# Altium schematic sheet PowerBoard_Rev1.SchDoc
size A4
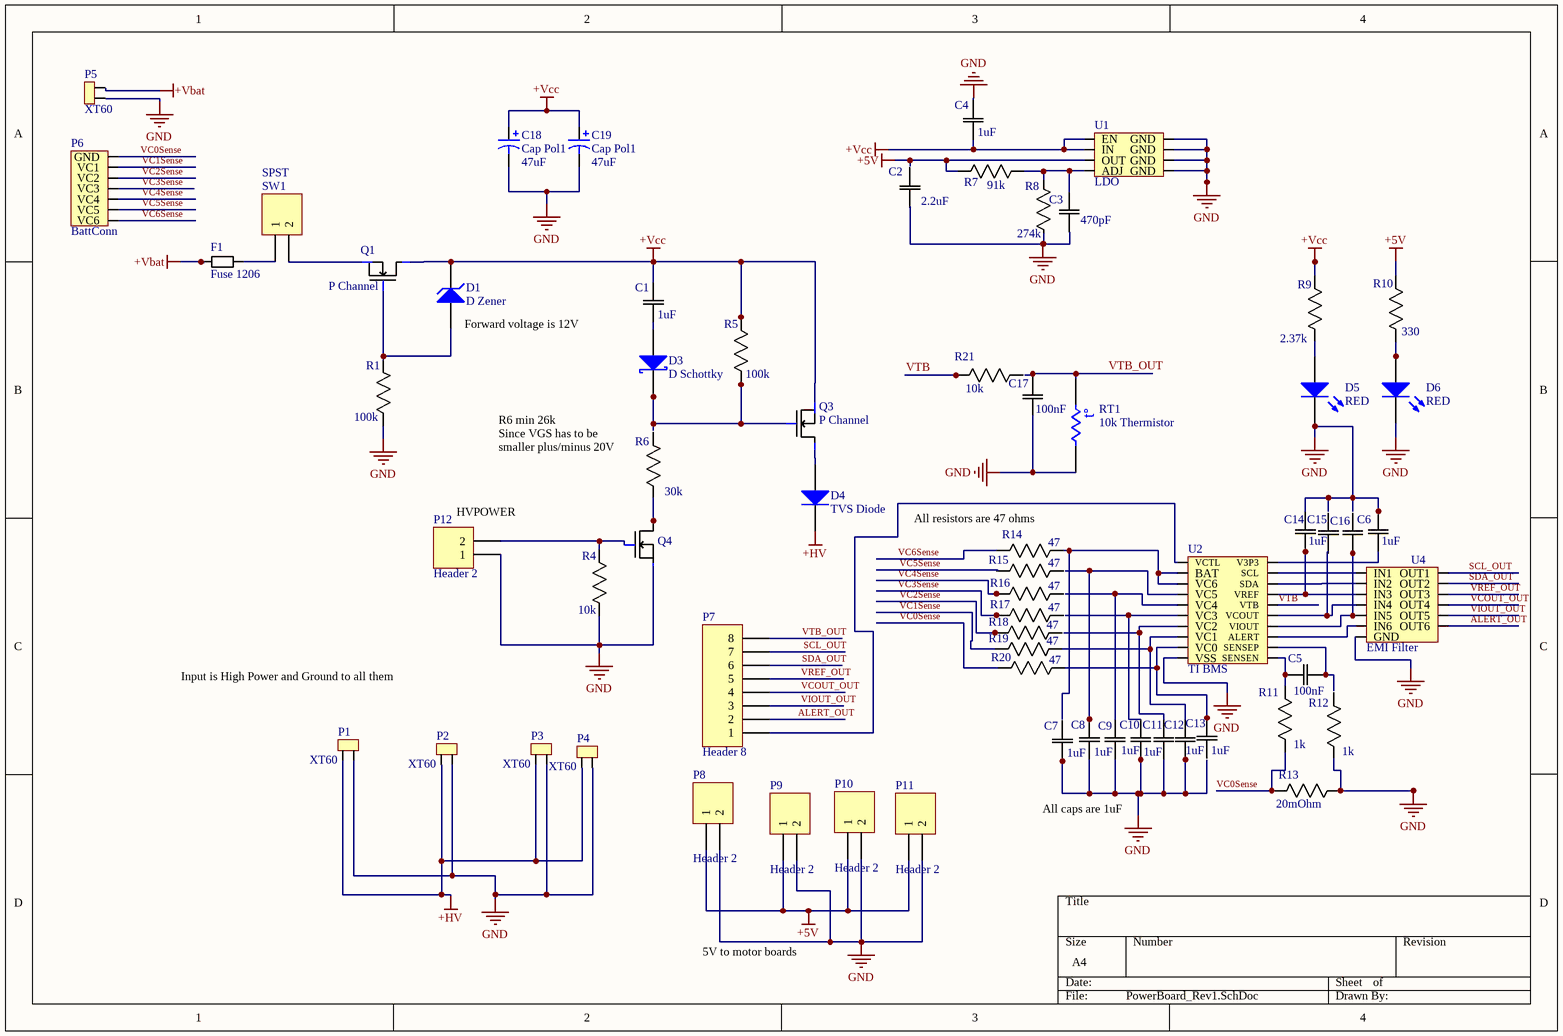
[diagram p0: PowerBoard_Rev1.SchDoc]

## Parts
C1  1uF  [CAPC2013X110N]
C2  2.2uF  [CAPC2013X110N]
C3  470pF  [CAPC2013X110N]
C4  1uF  [CAPC2013X110N]
C5  100nF  [CAPC2013X110N]
C6  1uF  [CAPC2013X110N]
C7  1uF  [CAPC2013X110N]
C8  1uF  [CAPC2013X110N]
C9  1uF-0805  [CAPC2013X110N]  (value not drawn)
C10  1uF  [CAPC2013X110N]
C11  1uF  [CAPC2013X110N]
C12  1uF  [CAPC2013X110N]
C13  1uF  [CAPC2013X110N]
C14  1uF  [CAPC2013X110N]
C15  100nF  [CAPC2013X110N]  (value not drawn)
C16  100nF  [CAPC2013X110N]  (value not drawn)
C17  100nF  [CAPC2013X110N]
C18  Cap Pol1  value 47uF  [RB7.6-15]
C19  Cap Pol1  value 47uF  [RB7.6-15]
D1  D Zener  [DIODE-0.7]
D3  D Schottky  [SMB]
D4  TVS Diode  [DO-35]
D5  RED  [3.2X1.6X1.1]
D6  RED  [3.2X1.6X1.1]
F1  Fuse 1206  [Fuse1206]
P1  XT60  [XT60Connector]
P2  XT60  [XT60Connector]
P3  XT60  [XT60Connector]
P4  XT60  [XT60Connector]
P5  XT60  [XT60Connector]
P6  BattConn  [6sBattConn]
P7  Header 8  [HDR1X8]
P8  Header 2  [HDR1X2]
P9  Header 2  [HDR1X2]
P10  Header 2  [HDR1X2]
P11  Header 2  [HDR1X2]
P12  Header 2  [HDR1X2]
Q1  P Channel  [PChannelMosfet]
Q3  P Channel  [PChannelMosfet]
Q4  N-Channel  [SOIC127P600X170-8N]  (value not drawn)
R1  100k  [RESC2013X65N]
R4  10k  [RESC2013X65N]
R5  100k  [RESC2013X65N]
R6  30k  [RESC2013X65N]
R7  91k  [RESC2013X65N]
R8  274k  [RESC2013X65N]
R9  2.37k  [RESC2013X65N]
R10  330  [RESC2013X65N]
R11  1k  [RESC2013X65N]
R12  1k  [RESC2013X65N]
R13  20mOhm  [RESC2013X65N]
R14  47  [RESC2013X65N]
R15  47  [RESC2013X65N]
R16  47  [RESC2013X65N]
R17  47  [RESC2013X65N]
R18  47  [RESC2013X65N]
R19  47  [RESC2013X65N]
R20  47  [RESC2013X65N]
R21  10k  [RESC2013X65N]
RT1  10k Thermistor  [6-0805_N]
SW1  SPST  [HDR1X2]
U1  LDO  [SOIC127P600X170-8N]
U2  TI BMS  [TSOP65P640X120-20N]
U4  EMI Filter  [Filter]

## Nets
+5V: P8.1 P9.1 P10.1 P11.1 R7.2(R2) R10.1(R1) U1.OUT
+HV: D4.2(K) P1.1 P2.1 P3.1 P4.1
+Vbat: F1.1 P5.2
+Vcc: C1.2(C2) C4.1(C1) C18.1 C19.1 D1.2(K) Q1.S Q3.D R5.1(R1) R9.1(R1) U1.EN U1.IN
GND: C2.1(C1) C4.2(C2) C6.2(C2) C7.1(C1) C8.1(C1) C9.1(C1) C10.1(C1) C11.1(C1) C12.1(C1) C14.2(C2) C17.1(C1) C18.2 C19.2 D5.2(K) D6.2(K) P1.2 P2.2 P3.2 P4.2 P5.1 P8.2 P9.2 P10.2 P11.2 P12.1 Q4.S R1.2(R2) R4.2(R2) R8.2(R2) R12.2(R2) R13.1(R1) RT1.2 U1.GND U2.VSS U4.GND
ALERT_OUT: P7.2 U4.12(OUT6)
SCL_OUT: P7.7 U4.7(OUT1)
SDA_OUT: P7.6 U4.8(OUT2)
VC0Sense: P6.GND R11.2(R2) R13.2(R2) R20.2(R2)
VC1Sense: P6.VC1 R19.2(R2)
VC2Sense: P6.VC2 R18.2(R2)
VC3Sense: P6.VC3 R17.2(R2)
VC4Sense: P6.VC4 R16.2(R2)
VC5Sense: P6.VC5
VC6Sense: P6.VC6 R14.2(R2)
VCOUT_OUT: P7.4 U4.10(OUT4)
VIOUT_OUT: P7.3 U4.11(OUT5)
VREF_OUT: P7.5 U4.9(OUT3)
VTB: R21.1(R1) U2.VTB
VTB_OUT: C17.2(C2) P7.8 RT1.1
NetC1_1: C1.1(C1) D3.1(A)
NetC3_2: C3.2(C2) R7.1(R1) R8.1(R1) U1.ADJ/BYP(ADJ)
NetC5_1: C5.1(C1) U2.SENSEP
NetC5_2: C5.2(C2) R11.1(R1) U2.SENSEN
NetC6_1: C6.1(C1) U2.V3P3
NetC8_2: C8.2(C2) U2.VC5
NetC9_2: C9.2(C2) U2.VC4
NetC10_2: C10.2(C2) U2.VC3
NetC11_2: C11.2(C2) U2.VC2
NetC12_2: C12.2(C2) R19.1(R1) U2.VC1
NetC13_2: C13.2(C2) R20.1(R1) U2.VC0
NetC14_1: C14.1(C1) U2.VREF U4.3(IN3)
NetC16_2: C16.2(C2) U2.VIOUT U4.5(IN5)
NetD1_1: D1.1(A) Q1.G R1.1(R1)
NetD3_2: D3.2(K) Q3.G R5.2(R2)
NetD4_1: D4.1(A) Q3.S
NetD5_1: D5.1(A) R9.2(R2)
NetD6_1: D6.1(A) R10.2(R2)
NetF1_2: F1.2 SW1.1
NetP7_1: P7.1 U2.VCTL
NetP12_2: P12.2 Q4.G R4.1(R1)
NetQ1_D: Q1.D SW1.2
NetQ4_D: Q4.D R6.2(R2)
NetR14_1: R14.1(R1) U2.BAT U2.VC6
NetU2_ALERT: U2.ALERT U4.6(IN6)
NetU2_SCL: U2.SCL U4.1(IN1)
NetU2_SDA: U2.SDA U4.2(IN2)
NetU2_VCOUT: U2.VCOUT U4.4(IN4)

Not connected (* = marked no-connect by the designer): C2 2(C2); C3 1(C1); C7 2(C2); C13 1(C1); C15 1(C1) 2(C2); C16 1(C1); R6 1(R1); R12 1(R1); R15 1(R1) 2(R2); R16 1(R1); R17 1(R1); R18 1(R1); R21 2(R2)

## Notes on the sheet
- (near D1) Forward voltage is 12V
- (near R6) R6 min 26k
  Since VGS has to be smaller plus/minus 20V
- (near P12) HVPOWER
- (near R14) All resistors are 47 ohms
- Input is High Power and Ground to all them
- All caps are 1uF
- 5V to motor boards
- (in symbol Res Thermal) t°

## Library data of the parts
C1 C4 C6-C8 C10-C14 = CAP 1uF 0805: CAP CER 1UF 50V X7R 0805; MP: CL21B105KBFNNNE; MF: Samsung Electro-Mechanics; Tolerance: 10%; Package: 0805; Price: 0,172 CAD; Value: 1uF; Digikey: 1276-1029-1-ND; Digikey Link: https://www.digikey.ca/product-detail/en/samsung-electro-mechanics/CL21B105KBFNNNE/1276-1029-1-ND/3889115; Rating: 50V
C2 = CAP 2.2uF 0805: CAP CER 1UF 50V X7R 0805; MP: C0805C225K4RACTU; MF: KEMET; Tolerance: 10%; Rating: 16V; Package: 0805; Price: 0,461 CAD; Value: 2.2uF; Digikey: 399-3523-1-ND; Digikey Link: https://www.digikey.ca/products/en?keywords=399-3523-1-ND
C3 = CAP 470pF 0805: CAP CER 470PF 50V C0G/NPO 0805; MP: CC0805JRNPO9BN471; MF: Yageo; Tolerance: 5%; Package: 0805; Price: 0,135 CAD; Value: 470pF; Digikey: 311-1119-1-ND; Digikey Link: https://www.digikey.ca/products/en?keywords=311-1119-1-ND; Rating: 50V
C5 C15-C17 = CAP 100nF 0805: CAP CER 0.1UF 50V X7R 0805; MP: CC0805KRX7R9BB104; MF: Yageo; Tolerance: 10%; Package: 0805; Price: 0,119 CAD; Value: 100nF; Digikey: 311-1140-1-ND; Digikey Link: https://www.digikey.ca/products/en?keywords=311-1140-1-ND; Rating: 50V
C9 = C0805C104K5RACTU: Capacitor; Ceramic; Cap; .100UF ; Tol+-10%; SMD; Vol-Rtg 50V; X7R, Tape/Reel; MP: CL21B105KBFNNNE; MF: Samsung Electro-Mechanics; Value: 1uF; Tolerance: 10%; Package: 0805 (2012 Metric); Price: 0.17300 CAD; Digikey: 1276-1029-1-ND; Rating: 50V; Digikey Link: https://www.digikey.ca/products/en?keywords=1276-1029-1-ND
C18 C19 = Cap Pol1: Polarized Capacitor (Radial); Published: 8-Jun-2000; LatestRevisionDate: 17-Jul-2002; LatestRevisionNote: Re-released for DXP Platform.; PackageReference: RB7.6-15; Publisher: Altium Limited; PackageDescription: Polarized Capacitor (Radial); 2 Leads
D1 = D Zener: Zener Diode 10V 1W ±5% Through Hole DO-41; MF: ON Semiconductor; MP: 1N4740ATR; Digikey: 1N4740AFSCT-ND; Digikey Link: https://www.digikey.ca/product-detail/en/on-semiconductor/1N4740ATR/1N4740AFSCT-ND/1532756; Value: 10V; Rating: 1W
D3 = D Schottky: Schottky Diode; Parameter 1: *
D4 = Diode 1N914: High Conductance Fast Diode; MF: STMicroelectronics; MP: P6KE30CA; Rating: 54V; ComponentLink1Description: Manufacturer Link; ComponentLink1URL: http://www.fairchildsemi.com/; ComponentLink2Description: Datasheet; ComponentLink2URL: http://www.fairchildsemi.com/ds/1N%2F1N4448.pdf; Digikey: 497-12048-1-ND; Digikey Link: https://www.digikey.ca/products/en?keywords=497-12048-1-ND; Price: 0.63800 CAD; Value: TVS
D5 D6 = LED RED SMD: Typical RED, GREEN, YELLOW, AMBER GaAs LED; MF: Lite-On Inc.; MP: LTST-C190CKT; Rating: 1.8V; Digikey: 160-1181-1-ND; Digikey Link: https://www.digikey.ca/products/en?keywords=160-1181-1-ND; Package: 0603
F1 = Fuse 10A 1206: 10A 32V AC 63V DC Fuse Board Mount (Cartridge Style Excluded) Surface Mount 1206 (3216 Metric); MF: Schurter Inc.; MP: 3413.0328.22; Digikey: 486-1686-1-ND; Rating: 10A; Digikey Link: https://www.digikey.ca/products/en?keywords=486-1686-1-ND
P1-P5 = XT60 Connector: XT60 CONNECTORS FEMALE PAIR; MF: SparkFun Electronics; MP: PRT-10474; Digikey: 1568-1816-ND; Digikey Link: https://www.digikey.ca/product-detail/en/sparkfun-electronics/PRT-10474/1568-1816-ND/8258064; Package: XT60; Price: 2.13000 CAD; Value: N/A
P6 = Component_1
P7 = Header 8: Header, 8-Pin; LatestRevisionDate: 17-Jul-2002; LatestRevisionNote: Re-released for DXP Platform.; Publisher: Altium Limited
P8-P12 = Header 2: Header, 2-Pin; LatestRevisionDate: 17-Jul-2002; LatestRevisionNote: Re-released for DXP Platform.; Publisher: Altium Limited
Q1 Q3 = Mosfet P Channel: MF: Vishay Siliconix; MP: SI4497DY-T1-GE3; Rating: 30V 36A; Value: P-Channel; Digikey: SI4497DY-T1-GE3CT-ND; Digikey Link: https://www.digikey.ca/products/en?keywords=SI4497DY-T1-GE3CT-ND; Package: 8-SOIC; Tolerance: N/A
Q4 = Mosfet N Channel 8-SOIC: MOSFET N-CH 30V 18.5A 8-SOIC; MF: ON Semiconductor; MP: FDS8813NZ; Digikey: FDS8813NZCT-ND; Price: 1.727 CAD; Rating: 30V; Digikey Link: https://www.digikey.ca/product-detail/en/on-semiconductor/FDS8813NZ/FDS8813NZCT-ND/1626932; Package: 8-SOIC
R1 R5 = RES 100k 0805: RES SMD 100K OHM 1% 1/8W 0805; MP: RC0805FR-07100KL; MF: Yageo; Rating: 0.125W; Digikey: 311-100KCRCT-ND; Price: 0.058 CAD; Package: 0805; Value: 100k; Digikey Link: https://www.digikey.ca/products/en?keywords=311-100KCRCT-ND; Tolerance: 1%
R4 R21 = RES 10k 0805: RES SMD 10K OHM 1% 1/8W 0805; MP: RC0805FR-0710KL; MF: Yageo; Rating: 0.125W; Digikey: 311-10.0KCRCT-ND; Price: 0.061 CAD; Package: 0805; Value: 10k; Digikey Link: https://www.digikey.ca/products/en?keywords=311-10.0KCRCT-ND; Tolerance: 1%
R6 = RES 30k 0805: RES SMD 30K OHM 1% 1/8W 0805; MP: RC0805FR-0730KL; MF: Yageo; Rating: 0.125W; Digikey: 311-30.0KCRDKR-ND; Price: 0.061 CAD; Package: 0805; Value: 30k; Digikey Link: https://www.digikey.ca/products/en?keywords=311-30.0KCRDKR-ND; Tolerance: 1%
R7 = RES 91k 0805: RES SMD 91K OHM 1% 1/8W 0805; MP: RC0805FR-0791KL; MF: Yageo; Rating: 0.125W; Digikey: 311-91.0KCRCT-ND; Price: 0.061 CAD; Package: 0805; Value: 91k; Digikey Link: https://www.digikey.ca/products/en?keywords=311-91.0KCRCT-ND; Tolerance: 1%
R8 = RES 274k 0805: RES SMD 274K OHM 1% 1/8W 0805; MP: RC0805FR-07274KL; MF: Yageo; Rating: 0.125W; Digikey: 311-274KCRCT-ND; Price: 0.061 CAD; Package: 0805; Value: 274k; Digikey Link: https://www.digikey.ca/products/en?keywords=311-274KCRCT-ND; Tolerance: 1%
R9 = RES 2.37k 0805: RES SMD 2.37kOhm 1/4W 0805; MP: RK73H2ATTD2371F; MF: KOA Speer Electronics, Inc.; Rating: 0.25W; Digikey: 2019-RK73H2ATTD2371FCT-ND; Price: 0.053 CAD; Package: 0805; Value: 2.37k; Digikey Link: https://www.digikey.ca/products/en?keywords=2019-RK73H2ATTD2371FCT-ND
R10 = RES 330 0805: RES SMD 330 OHM 1% 1/8W 0805; MP: RC0805FR-07330RL; MF: Yageo; Rating: 0.125W; Digikey: 311-330CRCT-ND; Price: 0.061 CAD; Package: 0805; Value: 330; Digikey Link: https://www.digikey.ca/products/en?keywords=311-330CRCT-ND
R11 R12 = RES 1k 0805: RES SMD 1K OHM 5% 1/8W 0805; MP: RC0805JR-071KL; MF: Yageo; Rating: 0.125W; Digikey: 311-1.0KARCT-ND; Price: 0.048 CAD; Package: 0805; Value: 1k; Digikey Link: https://www.digikey.ca/products/en?keywords=311-1.0KARCT-ND; Tolerance: 5%
R13 = RES 20mOhm 0805: RES 0.02 OHM 1% 1/2W 0805; MP: ERJ-6BWFR020V; MF: Panasonic Electronic Components; Rating: 0.5W; Digikey: P.02AQCT-ND; Price: 0.088 CAD; Package: 0805; Value: 20mOhm; Digikey Link: https://www.digikey.ca/products/en?keywords=P.02AQCT-ND; Tolerance: 1%
R14-R20 = RES 47 0805: RES SMD 47 OHM 1% 1/8W 0805; MP: RC0805FR-0747RL; MF: Yageo; Rating: 0.125W; Digikey: 311-47.0CRCT-ND; Price: 0.061 CAD; Package: 0805; Value: 47; Digikey Link: https://www.digikey.ca/products/en?keywords=311-47.0CRCT-ND; Tolerance: 1%
RT1 = Res Thermal: 490-2456-1-ND; Published: 24-Mar-1999; LatestRevisionDate: 29-May-2009; LatestRevisionNote: IPC-7351 Footprint Added.; PackageVersion: Mar-2003; PackageReference: 6-0805; Publisher: Altium Limited; PackageDescription: Chip Resistor 0805 Case Size; Code_IPC: RESC2012
SW1 = Header 2: SPST Switch; LatestRevisionDate: 17-Jul-2002; LatestRevisionNote: Re-released for DXP Platform.; Publisher: Altium Limited
U1 = U?
U2 = U?: MF: Texas Instruments; MP: BQ76925PWR; Digikey: 296-29341-1-ND; Price: 3.62200 CAD; Digikey Link: https://www.digikey.ca/products/en?keywords=296-29341-1-ND
U4 = EMIFilter